# Altium schematic sheet JTAG.SchDoc: Evaluation Board 3.2
size A3; Organization: Toradex AG; Address1: Altsagenstrasse 5; Address2: Horw; Address3: 6048; Address4: Switzerland; DocumentNumber: 20; Revision: V3.2; SheetNumber: 20; SheetTotal: 23; PageSetup: Record=PageOptions|CenterHorizontal=True|CenterVertical=True|PrintScale=0.73|XCorrection=1.00|YCorrection=1.00|PrintKind=0|BorderSize=5000000|LeftOffset=0|BottomOffset=0|Orientation=2|PaperLength=1000|PaperWidth=1000|Scale=100|PaperSource=7|PrintQuality=-4|MediaType=1|DitherType=10|PaperKind=A4|PrintScaleMode=1
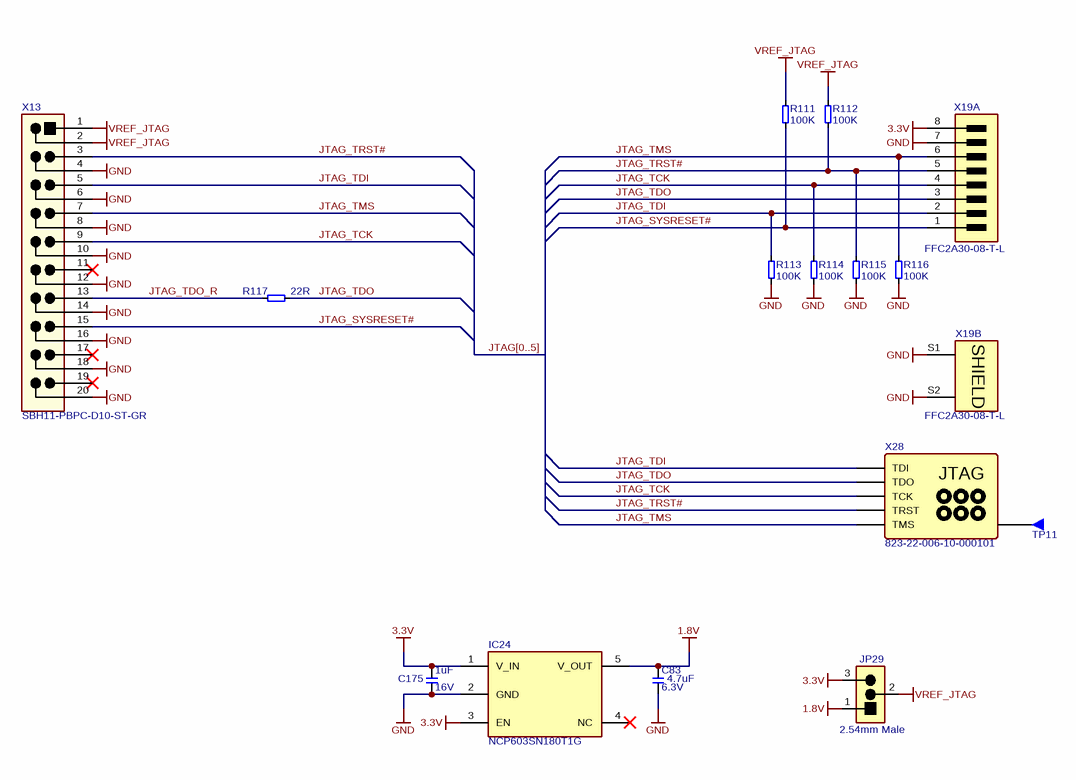
[diagram p0: JTAG.SchDoc]

## Parts
C83  Rating: 6.3V  [T_CAPC0603X33N]  (hidden comment: 4.7uF)
C175  Rating: 16V  [T_CAPC0603X33N]  (hidden comment: 1uF)
IC24  NCP603SN180T1G  [T_ON_NCP603SN180T1G]
JP29  826936-3  [T_TYCO_826936-3]  (value not drawn)
R111  100K  [T_RESC0603X30N]
R112  100K  [T_RESC0603X30N]
R113  100K  [T_RESC0603X30N]
R114  100K  [T_RESC0603X30N]
R115  100K  [T_RESC0603X30N]
R116  100K  [T_RESC0603X30N]
R117  22R  [T_RESC0603X30N]
TP11  Testpin  [T_TP-THT]  (value not drawn)
X13  SBH11-PBPC-D10-ST-GR  [T_Sullins_SBH11-PBPC-D10-ST-GR]
X19  FFC2A30-08-T-L  [T_GCT_FFC2A30-08-T-L]  (parts A,B of 2)
X28  Manufacturer Part No.: 823-22-006-10-000101  [T_MILL-MAX_823-22-006-10-000101]  (hidden comment: CON-MM-823-22-006-10-000101)

## Nets
1.8V: C83.2 IC24.5(V_OUT) JP29.1
3.3V: C175.2 IC24.1(V_IN) IC24.3(EN) JP29.3 X19.8
GND: C83.1 C175.1 IC24.2(GND) R113.1 R114.1 R115.1 R116.1 X13.4 X13.6 X13.8 X13.10 X13.12 X13.14 X13.16 X13.18 X13.20 X19.7 X19.S1(SHIELD) X19.S2(SHIELD)
VREF_JTAG: JP29.2 R111.2 R112.2 X13.1 X13.2
JTAG_SYSRESET#: R111.1 X13.15 X19.1
JTAG_TCK: R114.2 X13.9 X19.4 X28.3(TCK)
JTAG_TDI: R113.2 X13.5 X19.2 X28.1(TDI)
JTAG_TDO: R117.2 X19.3 X28.2(TDO)
JTAG_TDO_R: R117.1 X13.13
JTAG_TMS: R116.2 X13.7 X19.6 X28.5(TMS)
JTAG_TRST#: R112.1 R115.2 X13.3 X19.5 X28.4(TRST)
NetTP11_1: TP11.1 X28.6

Not connected (* = marked no-connect by the designer): IC24 4(NC)*; X13 11* 17* 19*

## Buses and harness runs
bus JTAG[0..5]

## Notes on the sheet
- (near JP29) 2.54mm Male
- Title
- Size:
- Date:
- A3
- Number:
- Time:
- Revision:
- Sheet
- of
- File:
- (in symbol CON-MM-823-22-006-10-000101) JTAG

## Library data of the parts
C83 = C-X5R-4.7uF-6.3V-20%-0603: Capacitor Ceramic X5R 4.7uF 6.3V 20% 0603; Tolerance: 20%; Type: X5R; Value: 4.7uF
C175 = C-X5R-1uF-16V-20%-0603: Capacitor Ceramic X5R 1uF 16V 20% 0603; Tolerance: 20%; Type: X5R; Value: 1uF
IC24 = IC-ON-NCP603SN180T1G: CMOS LDO Regulator; Manufacturer Name: ON; Manufacturer Part No.: NCP603SN180T1G
JP29 = CON-Tyco-826936-3-1X3-2.54mm-JP_1: Jumper, 3-Pin; Manufacturer Name: Tyco; No. of ways: 1X3; Pitch: 2.54mm; Manufacturer Part No.: 826936-3
R111-R116 = R-100KR-63mW-5%-0603: Resistor 100 Kohm 63mW 5% 0603; Value: 100KR; Rating: 63mW; Tolerance: 5%
R117 = R-22R-63mW-5%-0603: Resistor 22 ohm 63mW 5% 0603; Rating: 63mW; Tolerance: 5%; Value: 22R
TP11 = Testpin: Testpin TH
X13 = CON-Sullins-SBH11-PBPC-D10-ST-GR: Header shrouded male, 2x10 pin 2.54mm pitch; Manufacturer Name: Sullins; No. of ways: 2x10; Pitch: 2.54mm; Manufacturer Part No.: SBH11-PBPC-D10-ST-GR
X19 = CON-GCT-FFC2A30-08-T-L-0.5mm: 0.50mm Pitch FFC/FPC JTAG Connector Vertical; Manufacturer Name: GCT; No. of ways: 8; Pitch: 0.5mm; Manufacturer Part No.: FFC2A30-08-T-L
X28 = CON-MM-823-22-006-10-000101: JTAG Pogo pins; Manufacturer Name: Mill-Max